# EAGLE design tiny__THT (EAGLE 6.6.0)
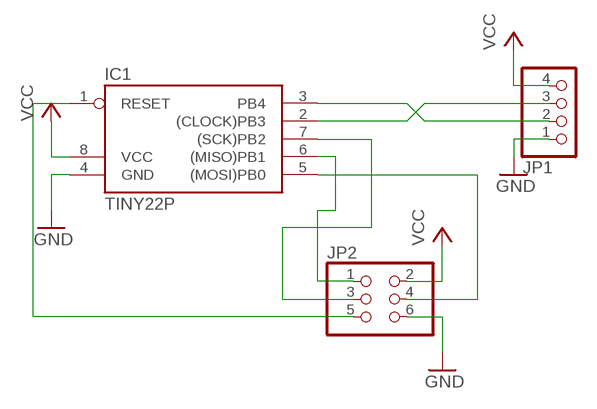
[diagram p0: schematic, sheet 1]

## Parts
IC1  TINY22P  [DIL08]
JP1  PINHD-1X4  [1X04]
JP2  PINHD-2X3  [2X03]

## Nets
GND: IC1.4(GND) JP1.1 JP2.6
N$1: IC1.2((CLOCK)PB3) JP1.3
N$2: IC1.3(PB4) JP1.2
N$3: IC1.1(RESET) JP2.5
N$7: IC1.5((MOSI)PB0) JP2.4
N$8: IC1.6((MISO)PB1) JP2.1
N$9: IC1.7((SCK)PB2) JP2.3
VCC: IC1.8(VCC) JP1.4 JP2.2

## Library data of the parts
IC1 = atmel:TINY22: MICROCONTROLLER 1K ROM 128 bytes RAM 128 bytes EEPROM; OC_FARNELL: unknown; OC_NEWARK: unknown
JP1 = pinhead:PINHD-1X4: PIN HEADER
JP2 = pinhead:PINHD-2X3: PIN HEADER

## Board
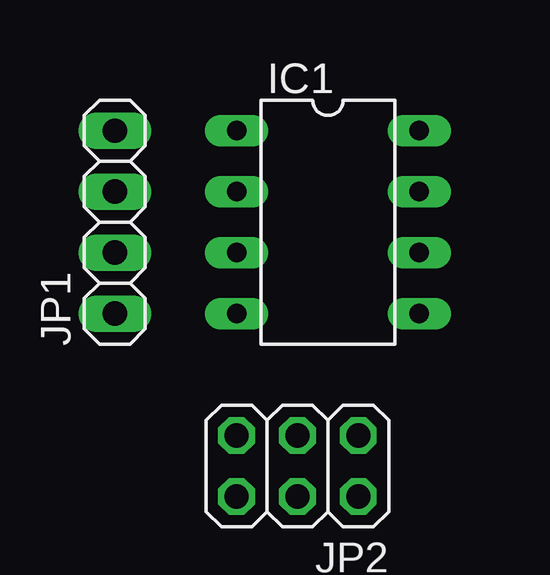
[diagram p1: board, top side]
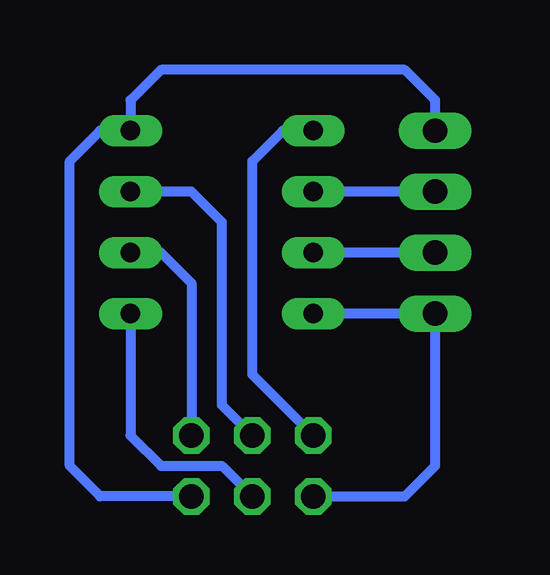
[diagram p2: board, bottom side, seen from below]

No outline drawn. Coordinates in mm, seen from the top.
Copper layers (1*16): Top 0.035mm / dielectric 1.5mm / Bottom 0.035mm
Design rules "default": minimum track width 10mil, minimum drill 24mil, track to track 8mil, track to pad 8mil, pad to pad 8mil, via to via 8mil, smd to smd 8mil, copper to edge 40mil, drill to drill 8mil, minimum pad ring 10mil, minimum via ring 8mil, stop-mask expansion 4mil, vias tented up to drill 0mil, thermal gap 10mil

### Footprints (pad centres in the part's own frame; a part is rotated, then mirrored left to right if it is on the bottom)
DIL08 = drill 0.813 long: 1 -3.81,-3.81; 2 -1.27,-3.81; 3 1.27,-3.81; 4 3.81,-3.81; 5 3.81,3.81; 6 1.27,3.81; 7 -1.27,3.81; 8 -3.81,3.81
1X04 = drill 1.016 long: 1 -3.81,0; 2 -1.27,0; 3 1.27,0; 4 3.81,0
2X03 = drill 1.016 octagon: 1 -2.54,-1.27; 2 -2.54,1.27; 3 0,-1.27; 4 0,1.27; 5 2.54,-1.27; 6 2.54,1.27

### Placement (x,y rotation side)
IC1  8.89,20.32 270 top
JP1  0,20.32 90 top
JP2  7.62,10.16 180 top

### Tracks (layer width: path | path; a pad name or v marks a point on that pad's centre or on a via)
GND
  Bottom 0.406: JP2.6 1.27,8.89 0,10.16 JP1.1 IC1.4
N$1
  Bottom 0.406: JP1.3 IC1.2
N$2
  Bottom 0.406: JP1.2 IC1.3
N$3
  Bottom 0.406: JP2.5 7.62,13.97 7.62,22.86 6.35,24.13 IC1.1
N$7
  Bottom 0.406: IC1.5 12.7,11.43 11.43,10.16 8.89,10.16 JP2.4
N$8
  Bottom 0.406: IC1.6 11.43,19.05 10.16,17.78 JP2.1
N$9
  Bottom 0.406: JP2.3 8.89,12.7 8.89,20.32 10.16,21.59 IC1.7
VCC
  Bottom 0.406: JP1.4 0,25.4 1.27,26.67 11.43,26.67 12.7,25.4 IC1.8 13.97,24.13 15.24,22.86 15.24,10.16 13.97,8.89 JP2.2